# Altium schematic sheet Power Budget.SchDoc: Power Budget
size A4; Date: Dec. 28th, 2022; Author: Karl Asseily; DrawnBy: Karl Asseily; DocumentNumber: 202301161053; Revision: 1.2; SheetNumber: 3; SheetTotal: 20
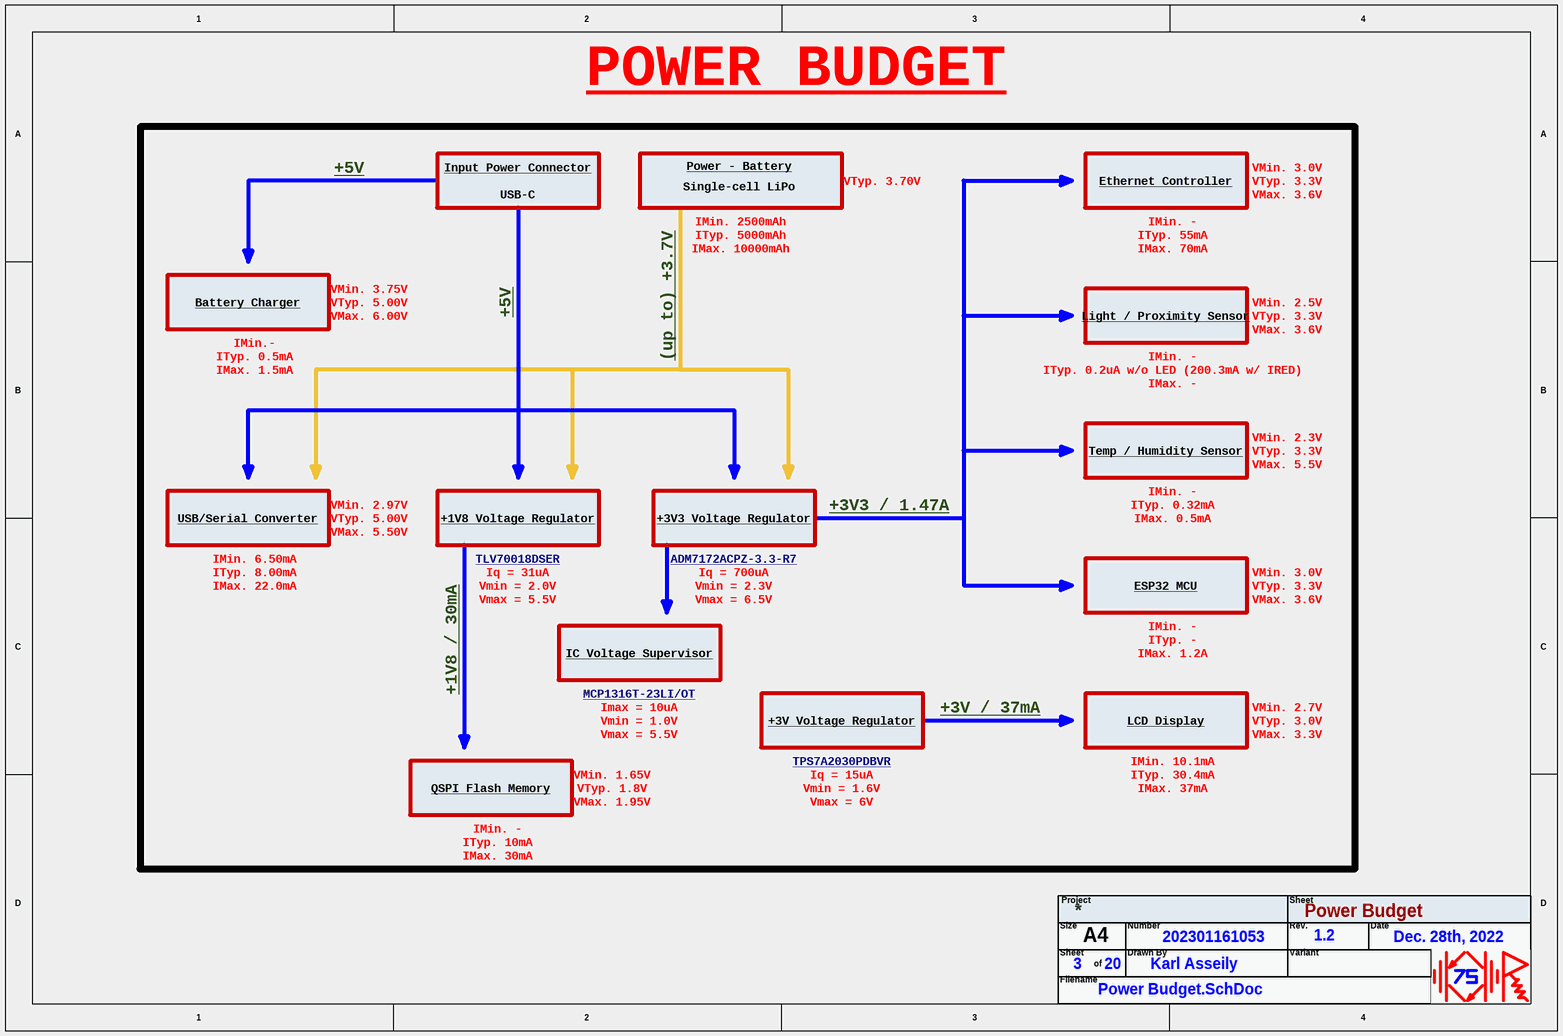
[diagram p0: Power Budget.SchDoc]

## Notes on the sheet
- POWER BUDGET
- +5V
- Input Power Connector
- Power - Battery
- Single-cell LiPo
- VTyp. 3.70V
- Ethernet Controller
- VMin. 3.0V
- VTyp. 3.3V
- USB-C
- IMin. 2500mAh
- ITyp. 5000mAh
- IMax. 10000mAh
- IMin. -
- ITyp. 55mA
- IMax. 70mA
- VMax. 3.6V
- Battery Charger
- VMin. 3.75V
- VTyp. 5.00V
- VMax. 6.00V
- (up to) +3.7V
- Light / Proximity Sensor
- VMin. 2.5V
- IMin.-
- ITyp. 0.5mA
- IMax. 1.5mA
- ITyp. 0.2uA w/o LED (200.3mA w/ IRED)
- IMax. -
- Temp / Humidity Sensor
- VMin. 2.3V
- USB/Serial Converter
- VMin. 2.97V
- +1V8 Voltage Regulator
- +3V3 Voltage Regulator
- +3V3 / 1.47A
- ITyp. 0.32mA
- IMax. 0.5mA
- VMax. 5.5V
- IMin. 6.50mA
- ITyp. 8.00mA
- IMax. 22.0mA
- VMax. 5.50V
- TLV70018DSER <https://www.digikey.com/en/products/detail/texas-instruments/TLV70018DSER/2232569>
- Iq = 31uA
- Vmin = 2.0V
- ADM7172ACPZ-3.3-R7 <https://www.digikey.com/en/products/detail/analog-devices-inc/ADM7172ACPZ-3-3-R7/5011546?s=N4IgTCBcDaIIIBECyB2AjCscDCAFAWgLQDMAdMYQEoogC6AvkA>
- Iq = 700uA
- Vmin = 2.3V
- ESP32 MCU
- +1V8 / 30mA
- Vmax = 5.5V
- IC Voltage Supervisor
- Vmax = 6.5V
- ITyp. -
- IMax. 1.2A
- Imax = 10uA
- Vmin = 1.0V
- MCP1316T-23LI/OT <https://www.digikey.com/en/products/detail/microchip-technology/MCP1316T-23LI-OT/6244321>
- +3V Voltage Regulator
- +3V / 37mA
- LCD Display
- VMin. 2.7V
- VTyp. 3.0V
- QSPI Flash Memory
- VMin. 1.65V
- VTyp. 1.8V
- TPS7A2030PDBVR <https://www.digikey.com/en/products/detail/texas-instruments/TPS7A2030PDBVR/13566871?s=N4IgTCBcDaICoAUDKB2AgmADAZkwgIgEIBqASiALoC%2BQA>
- Iq = 15uA
- Vmin = 1.6V
- IMin. 10.1mA
- ITyp. 30.4mA
- IMax. 37mA
- VMax. 3.3V
- ITyp. 10mA
- IMax. 30mA
- VMax. 1.95V
- Vmax = 6V
- Project
- Sheet
- Size
- Filename
- A4
- of
- Number
- Drawn By
- Rev.
- Variant
- Date